# EasyEDA Pro project ProPrj_MOSSE_2026-03-25.epro, board PCB4
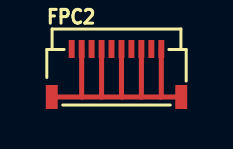
[diagram p11: board, top side]
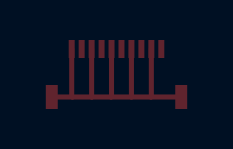
[diagram p12: board, bottom side, seen from below]

No outline. copper layers: Top Layer, Bottom Layer. Coordinates in mm from the lowest, leftmost part position.
Stack: Top Layer 0.035mm / Dielectric1 1.51mm FR4 er 4.5 / Bottom Layer 0.035mm

## Design rules (mm)
template: JLCPCB Capability(Two Layers Board)
spacing copperThickness1oz (default): track to track 0.102, other pairs 0.152 to 0.3
spacing copperThickness2oz: track to track 0.203, other pairs 0.152 to 0.3
track width copperThickness1oz (default): min 0.127, default 0.254, max 2.54
track width copperThickness2oz: min 0.203, default 0.254, max 2.54
differential pair differentialPair (default): width min 0.127, default 0.254, max 2.54; gap min 0.152, default 0.152
via viaSize (default): diameter min 0.5, default 0.61, max 10; hole min 0.3, default 0.305, max 6.3

## Placement (name value [footprint] x y rotation side)
FPC2  FH34SRJ-10S-0.5SH(50)  [FFC-SMD_10P-P0.50_FH34SRJ-10S-0.5SH]  0 0 0 top

## Footprints (pads in the part's own frame, mm; a bottom-side part is the same pattern mirrored in y, then rotated)
FFC-SMD_10P-P0.50_FH34SRJ-10S-0.5SH
  rect 0.3x0.9 smd: 1(2.25,1.2) 2(1.75,1.2) 3(1.25,1.2) 4(0.75,1.2) 5(0.25,1.2) 6(-0.25,1.2) 7(-0.75,1.2) 8(-1.25,1.2) 9(-1.75,1.2) 10(-2.25,1.2)
  rect 0.6x1.2 smd: 11(-3.25,-1.2) 12(3.25,-1.2)

## Nets
As in the schematic.

## Routing (per net, layer and track width the routed paths; a pad name or vN(x,y) marks a point on that pad's centre or on a via; arc(x,y) is an arc through that point)
GND: length 18.5
  Top Layer w0.254: -1.73,-1.2 -1.75,-1.18 FPC2.9 ; -1.73,-1.2 FPC2.11 ; -1.73,-1.2 0.27,-1.2 ; 2.21,-1.2 FPC2.12 ; 2.21,-1.2 2.25,-1.16 FPC2.1 ; 2.21,-1.2 1.24,-1.2 ; 0.27,-1.2 0.25,-1.18 FPC2.5 ; 0.27,-1.2 1.24,-1.2 ; FPC2.7 -0.75,-1.2 ; 1.24,-1.2 1.25,-1.19 FPC2.3
